# EAGLE design ChargerTimer_V5 (EAGLE 7.2.0)
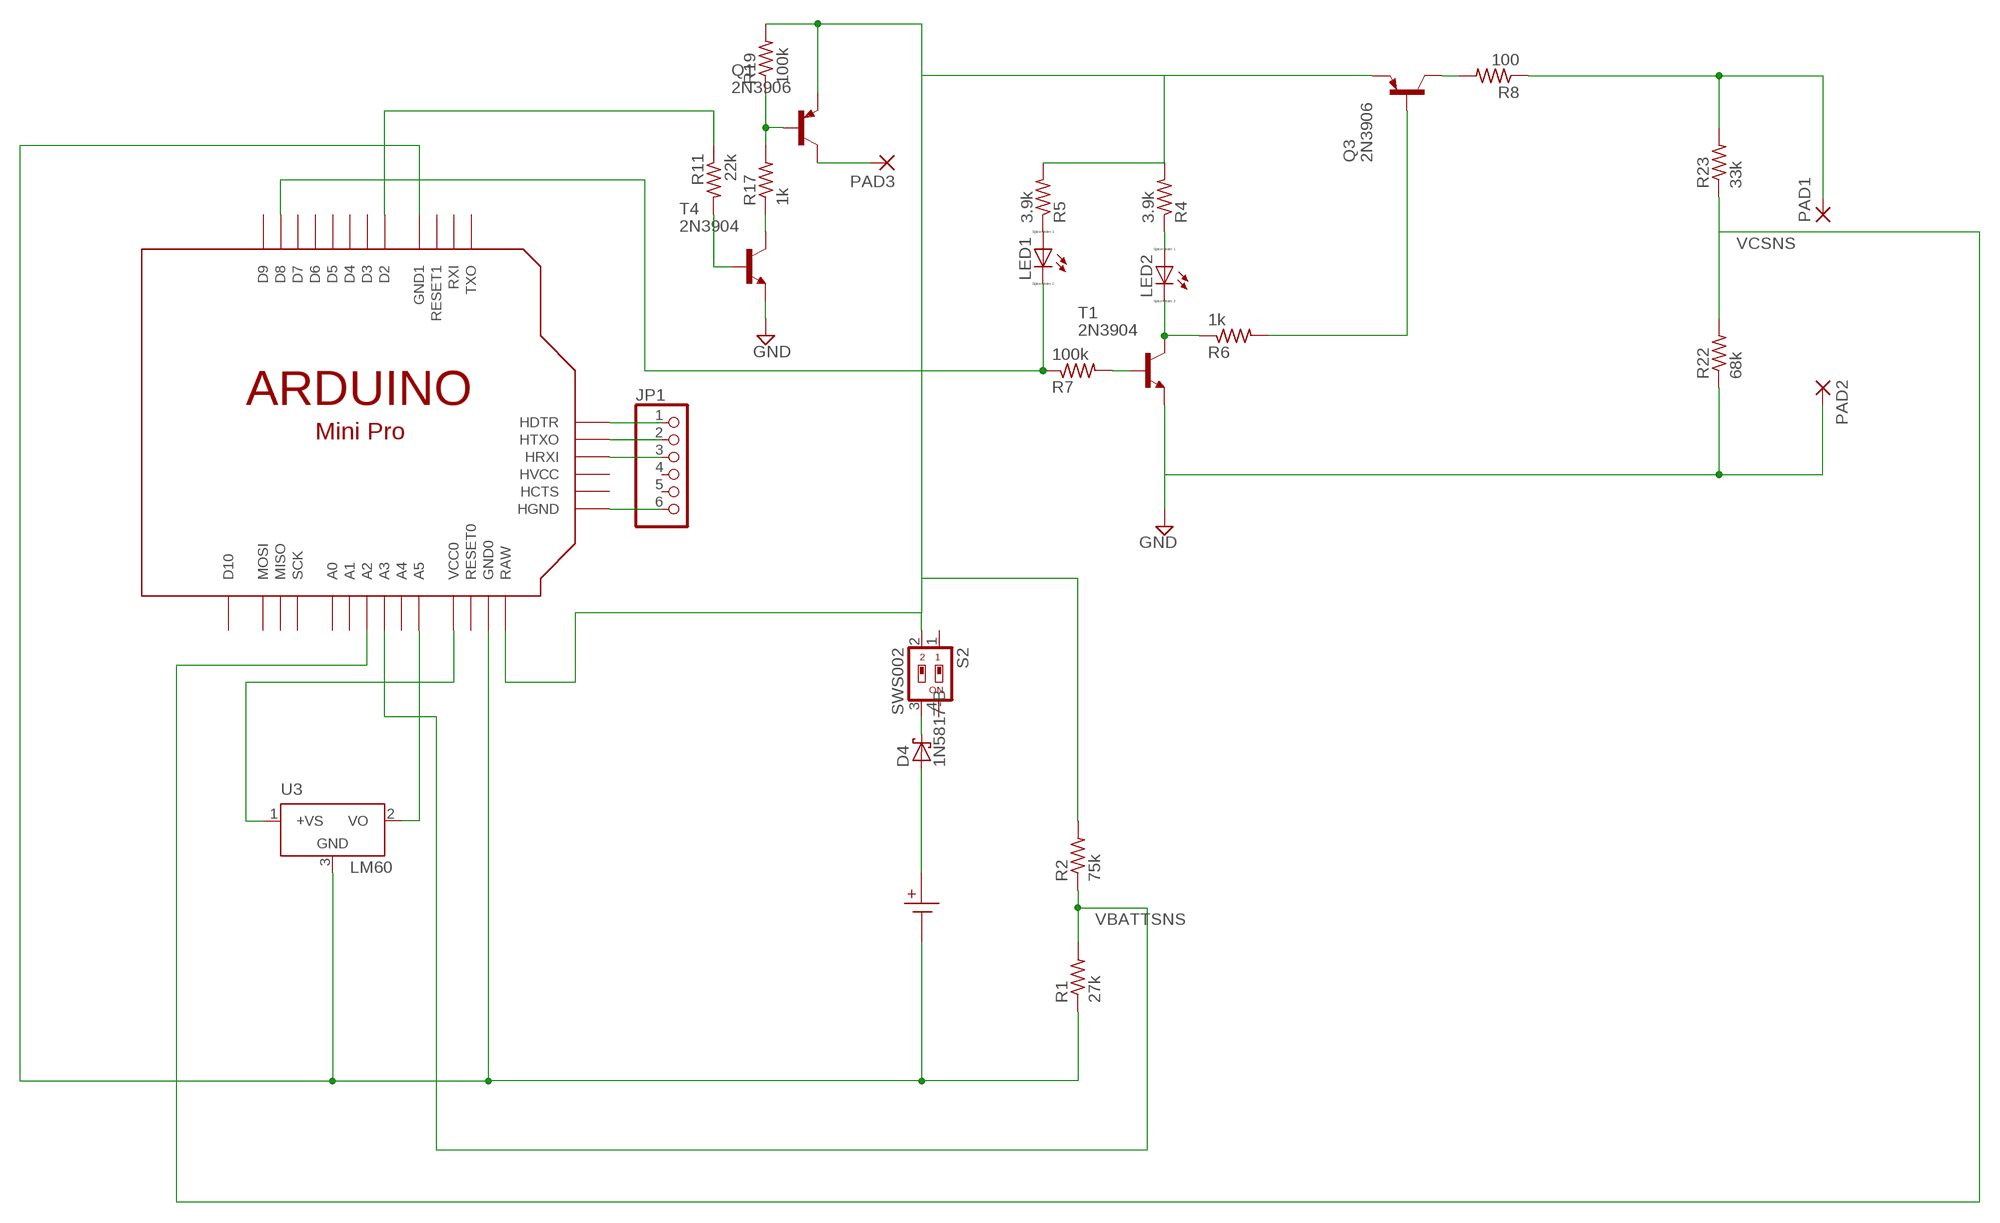
[diagram p0: schematic, sheet 1]

## Parts
D4  1N5817-B  [DO41-7.6]
JP1  PINHD-1X6  [1X06]
LED1  LED_ELD260  [LED_LD260]
LED2  LED_ELD260  [LED_LD260]
PAD1  2,15/1,0  [2,15/1,0]
PAD2  2,15/1,0  [2,15/1,0]
PAD3  2,15/1,0  [2,15/1,0]
Q1  2N3906  [TO92]
Q3  2N3906  [TO92]
R1  27k  R-US_0207/7  [0207/7]
R2  75k  R-US_0207/7  [0207/7]
R4  3.9k  R-US_0207/7  [0207/7]
R5  3.9k  R-US_0207/7  [0207/7]
R6  1k  R-US_0207/7  [0207/7]
R7  100k  R-US_0207/7  [0207/7]
R8  100  R-US_0207/7  [0207/7]
R11  22k  R-US_0207/7  [0207/7]
R17  1k  R-US_0207/7  [0207/7]
R19  100k  R-US_0207/7  [0207/7]
R22  68k  R-US_0207/7  [0207/7]
R23  33k  R-US_0207/7  [0207/7]
S2  SWS002  [SMS-002]
T1  2N3904  [TO92]
T4  2N3904  [TO92]
U3  LM60  [TO92]
U$1  BH1000G  [BH1000G]
U$4  ARDUINOMINI  [ARDUINOMINI]

## Nets
GND: T1.3(E) T4.3(E)
N$2: Q3.1(C) R8.2
N$3: LED1.K(C) R7.1 U$4.P$2(D8)
N$4: LED1.A R5.1
N$5: LED2.A R4.1
N$6: LED2.K(C) R6.1 T1.1(C)
N$7: Q3.2(B) R6.2
N$8: D4.C S2.3
N$9: PAD2.1(P) R22.1
N$10: R11.1 U$4.P$8(D2)
N$11: Q1.3(E) Q3.3(E) R2.2 R4.2 R5.2 R19.2 S2.2 U$4.P$19(RAW)
N$13: R7.2 T1.2(B)
N$21: R17.1 T4.1(C)
N$22: Q1.2(B) R17.2 R19.1
N$24: PAD3.1(P) Q1.1(C)
N$25: U3.2(VO) U$4.P$35(A5)
N$29: JP1.1 U$4.P$13(HDTR)
N$30: U3.1(+VS) U$4.P$22(VCC0)
N$31: R11.2 T4.2(B)
N$32: JP1.2 U$4.P$14(HTXO)
N$37: R1.1 U3.3(GND) U$1.NEG$2(P2) U$4.P$9(GND1) U$4.P$20(GND0)
N$38: D4.A U$1.POS$1(P1)
N$39: JP1.3 U$4.P$15(HRXI)
N$40: JP1.6 U$4.P$18(HGND)
N$41: PAD1.1(P) R8.1 R23.2
VBATTSNS: R1.2 R2.1 U$4.P$23(A3)
VCSNS: R22.2 R23.1 U$4.P$24(A2)
Unconnected: JP1.4 JP1.5 S2.1 S2.4 U$4.P$1(D9) U$4.P$3(D7) U$4.P$4(D6) U$4.P$5(D5) U$4.P$6(D4) U$4.P$7(D3) U$4.P$10(RESET1) U$4.P$11(RXI) U$4.P$12(TXO) U$4.P$16(HVCC) U$4.P$17(HCTS) U$4.P$21(RESET0) U$4.P$25(A1) U$4.P$26(A0) U$4.P$27(SCK) U$4.P$28(MISO) U$4.P$29(MOSI) U$4.P$30(D10) U$4.P$34(A4)

## Library data of the parts
D4 = diode:1N581*: 1.0A SCHOTTKY BARRIER RECTIFIER Source: http://www.diodes.com/datasheets/ds23001.pdf
JP1 = adafruit:PINHD-1X6: PIN HEADER
LED1 LED2 = eagle-ltspice:LED_E: LED Source: http://www.osram.convergy.de Source: www.luxeon.com Source: www.kingbright.com; SPICEMODEL: NONE; SPICEPREFIX: D; SPICETYPE: diode
PAD1-PAD3 = wirepad:2,15/1,0: THROUGH-HOLE PAD
Q1 Q3 = transistor-pnp:2N3906: PNP Transistor
R1 R2 R4-R8 R11 R17 R19 R22 R23 = rcl:R-US_: RESISTOR, American symbol
S2 = smd-special:SWS002: SMD Dip Switch 2 pol.
T1 T4 = transistor:2N3904: NPN TRANSISTOR
U3 = mydevices:LM60
U$1 = mymechanical:BH1000G: CR2477 Battery vertical holder
U$4 = adafruit:ARDUINOMINI

## Board
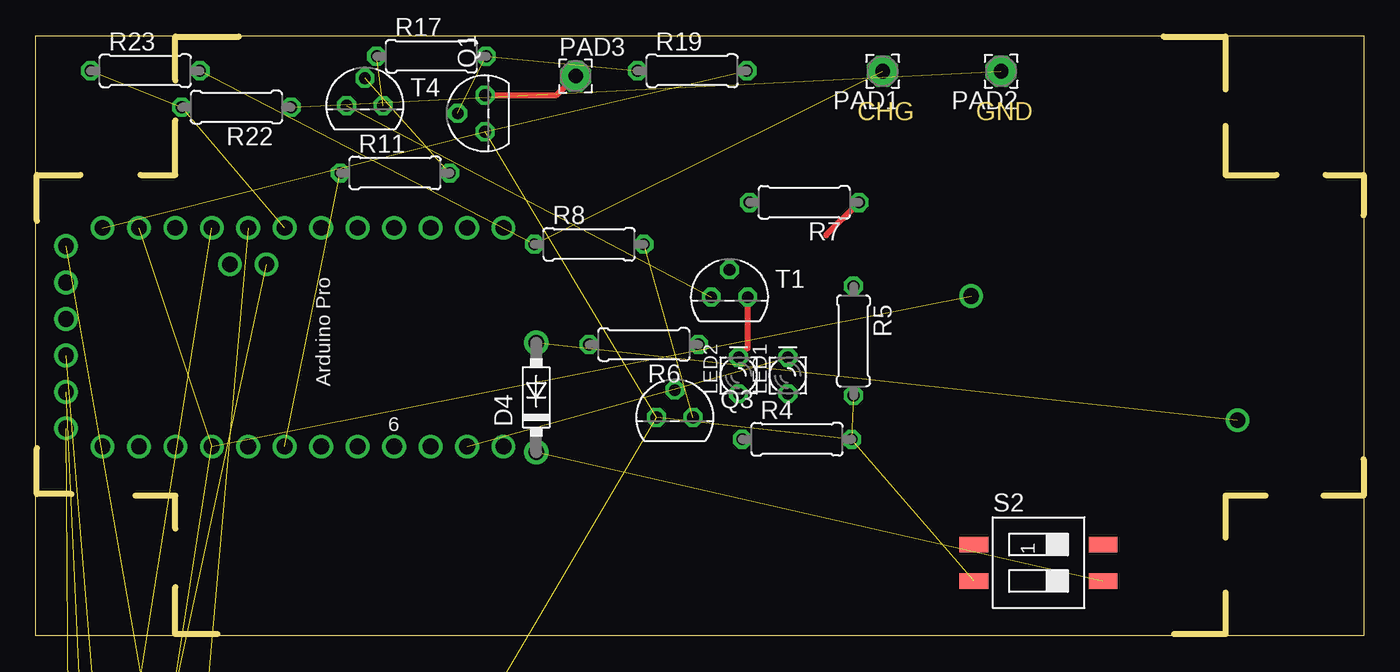
[diagram p1: board, top side]
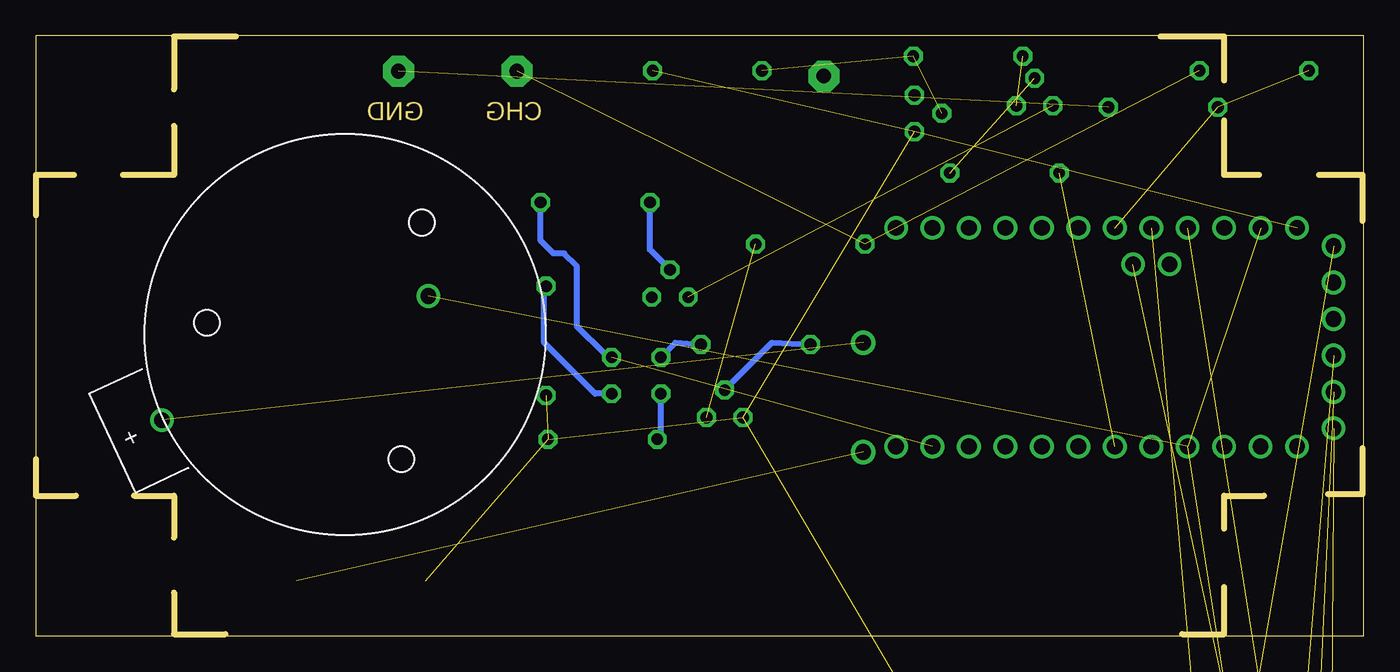
[diagram p2: board, bottom side, seen from below]

Size 92.5 x 41.8 mm. Coordinates in mm from the lower left corner, seen from the top.
Outline: 0,0 0,41.8 92.5,41.8 92.5,0 0,0
Copper layers (1*16): Top 0.035mm / dielectric 1.5mm / Bottom 0.035mm
Design rules "FarHorizonsMill": minimum track width 15mil, minimum drill 23mil, track to track 15mil, track to pad 15mil, pad to pad 15mil, via to via 15mil, smd to smd 8mil, copper to edge 40mil, drill to drill 20mil, minimum pad ring 10mil, minimum via ring 8mil, stop-mask expansion 4mil, vias tented up to drill 0mil, thermal gap 20mil
Milling: 24 lines

### Footprints (pad centres in the part's own frame; a part is rotated, then mirrored left to right if it is on the bottom)
DO41-7.6 = drill 1.1 pad 1.7: A 3.81,0; C -3.81,0
1X06 = drill 1.016 octagon: 1 -6.35,0; 2 -3.81,0; 3 -1.27,0; 4 1.27,0; 5 3.81,0; 6 6.35,0
LED_LD260 = drill 0.813 octagon: A -1.27,0; K 1.27,0
2,15/1,0 = drill 1.016 pad 2.159 octagon: 1 0,0
TO92 = drill 0.813 octagon: 1 1.27,0; 2 0,1.905; 3 -1.27,0
0207/7 = drill 0.813 octagon: 1 -3.81,0; 2 3.81,0
SMS-002 = smd 1.092 x 2.007: 1 -1.27,-4.496; 2 1.27,-4.496; 3 1.27,4.496; 4 -1.27,4.496
TO92' = drill 0.813 pad 1.676 octagon: 1 -1.27,0; 2 0,1.905; 3 1.27,0
BH1000G = drill 1.1: NEG$2 0,-6.502; POS$1 0,13.97
ARDUINOMINI = drill 1.1: P$1 -7.62,-13.97; P$2 -7.62,-11.43; P$3 -7.62,-8.89; P$4 -7.62,-6.35; P$5 -7.62,-3.81; P$6 -7.62,-1.27; P$7 -7.62,3.81; P$8 -7.62,1.27; P$9 -7.62,6.35; P$10 -7.62,8.89; P$11 -7.62,11.43; P$12 -7.62,13.97; P$13 -6.35,16.51; P$14 -3.81,16.51; P$15 -1.27,16.51; P$16 1.27,16.51; P$17 3.81,16.51; P$18 6.35,16.51; P$19 7.62,13.97; P$20 7.62,11.43; P$21 7.62,8.89; P$22 7.62,6.35; P$23 7.62,3.81; P$24 7.62,1.27; P$25 7.62,-1.27; P$26 7.62,-3.81; P$27 7.62,-6.35; P$28 7.62,-8.89; P$29 7.62,-11.43; P$30 7.62,-13.97; P$34 5.08,5.08; P$35 5.08,2.54

### Placement (x,y rotation side)
D4  34.86,16.61 90 top
JP1  8.89,-48.26 0 top  (outside the outline)
LED1  52.39,18.13 90 top
LED2  48.96,18.13 90 top
PAD1  58.99,39.34 180 top
PAD2  67.25,39.34 180 top
PAD3  37.6,39 0 top
Q1  31.3,36.4 90 top
Q3  44.51,15.21 0 top
R1  5.08,-38.1 0 top  (outside the outline)
R2  5.08,-43.18 0 top  (outside the outline)
R4  53.02,13.69 0 top
R5  56.96,20.54 270 top
R6  42.35,20.29 180 top
R7  53.53,30.2 180 top
R8  38.54,27.27 0 top
R11  25.02,32.25 0 top
R17  27.56,40.38 0 top
R19  45.72,39.37 0 top
R22  13.97,36.83 180 top
R23  7.62,39.37 0 top
S2  69.85,5.08 270 top
T1  48.32,23.59 0 top
T4  22.92,36.94 0 top
U3  LM60  [TO92']  3.81,-33.02 0 top  (outside the outline)
U$1  71.06,20.93 115 bottom
U$4  18.6,20.8 90 top

### Tracks (layer width: path | path; a pad name or v marks a point on that pad's centre or on a via)
GND  (1 unrouted)
N$2  (1 unrouted)
N$3  (1 unrouted)
  Top 0.406: 55.05,27.91 R7.1
  Bottom 0.406: LED1.K 52.39,19.53 52.51,19.66 52.89,19.66 54.8,21.56 54.8,25.75 55.69,26.64 56.45,26.64 57.34,27.53 R7.1
N$4
  Bottom 0.406: LED1.A 53.53,16.86 57.09,20.42 57.09,24.23 R5.1
N$5
  Bottom 0.406: R4.1 48.96,13.94 LED2.A
N$6
  Top 0.406: T1.1 49.59,20.04 LED2.K
  Bottom 0.406: LED2.K 47.94,20.42 R6.1
N$7
  Bottom 0.406: Q3.2 41.21,20.42 R6.2
N$8  (1 unrouted)
N$9  (1 unrouted)
N$10  (1 unrouted)
N$11  (7 unrouted)
N$13
  Bottom 0.406: T1.2 49.72,26.89 R7.2
N$21  (1 unrouted)
N$22  (2 unrouted)
N$24
  Top 0.406: Q1.1 36.27,37.67 PAD3.1
N$25  (1 unrouted)
N$29  (1 unrouted)
N$30  (1 unrouted)
N$31  (1 unrouted)
N$32  (1 unrouted)
N$37  (4 unrouted)
N$38  (1 unrouted)
N$39  (1 unrouted)
N$40  (1 unrouted)
N$41  (2 unrouted)
VBATTSNS  (2 unrouted)
VCSNS  (2 unrouted)

### Text on the board
Milling: CHG | GND